# Altium schematic sheet EtherCAT_Sheet.SchDoc
size 420 x 297 mm; SheetNumber: 12; SheetTotal: 14
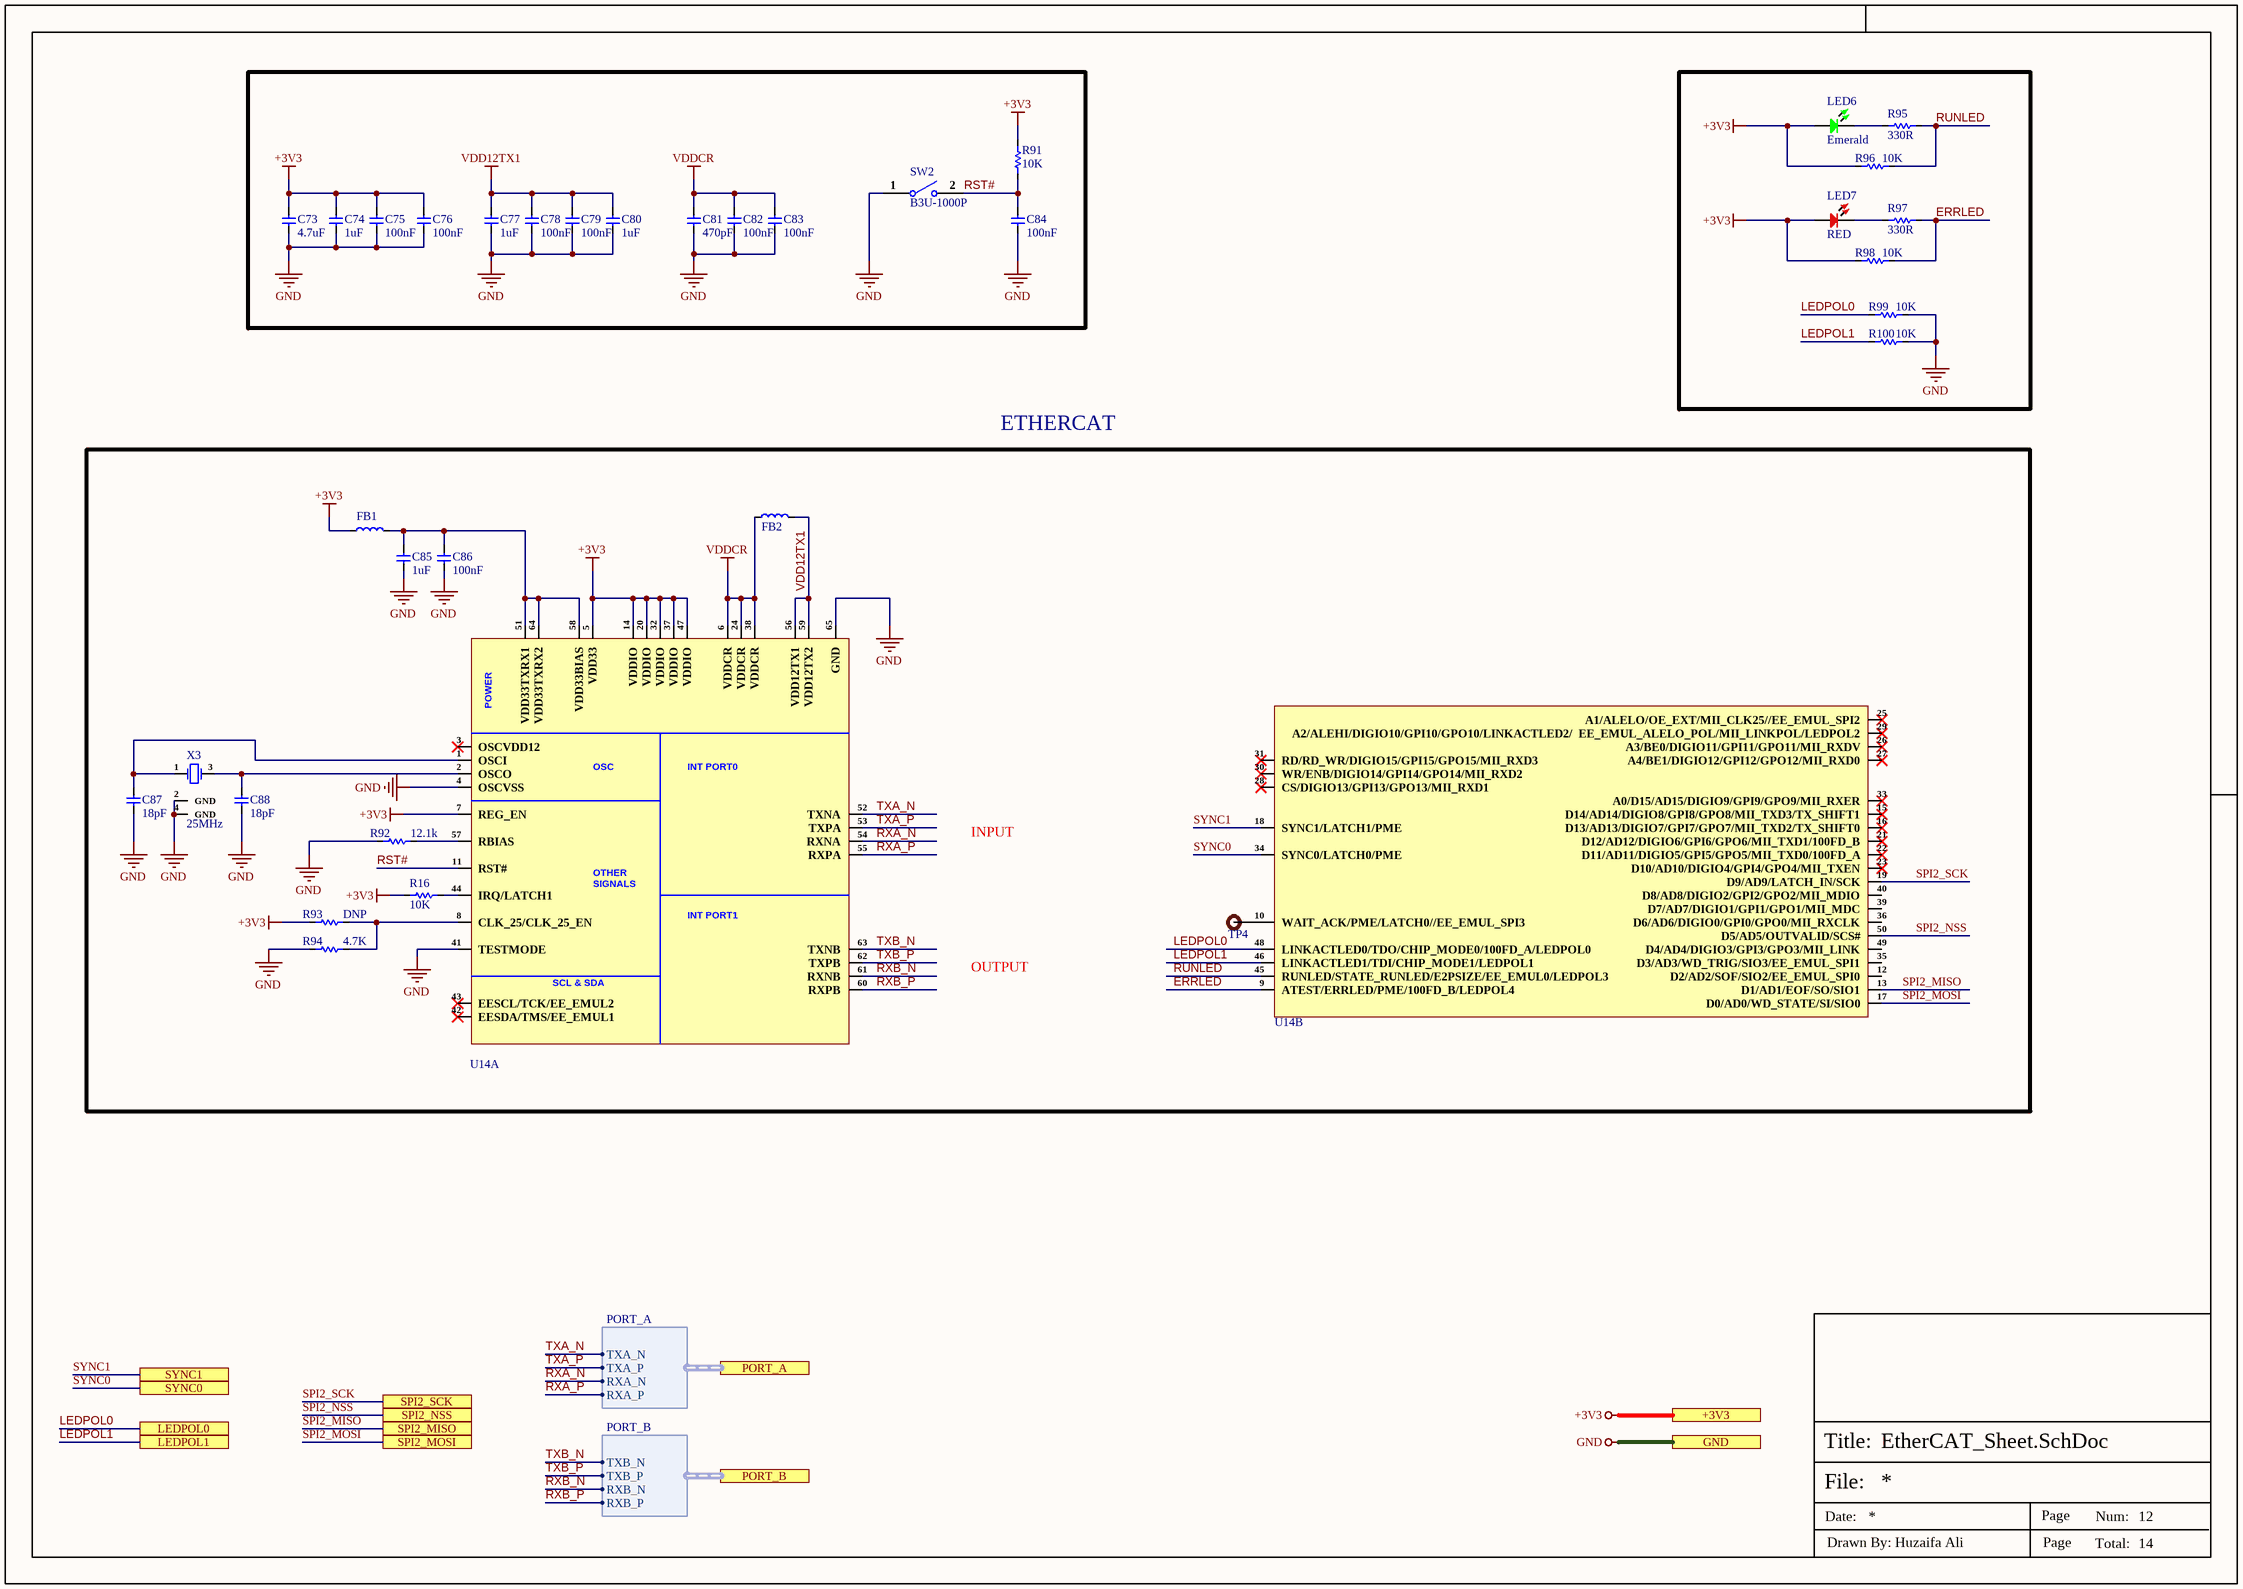
[diagram p0: EtherCAT_Sheet.SchDoc]

## Parts
C73  4.7uF  [Cap-0402]
C74  1uF  [Cap-0402]
C75  100nF  [cap-0402]
C76  100nF  [cap-0402]
C77  1uF  [Cap-0402]
C78  100nF  [cap-0402]
C79  100nF  [cap-0402]
C80  1uF  [Cap-0402]
C81  470pF  [Cap-0603]
C82  100nF  [cap-0402]
C83  100nF  [cap-0402]
C84  100nF  [cap-0402]
C85  1uF  [Cap-0402]
C86  100nF  [cap-0402]
C87  18pF  [Cap-0402]
C88  18pF  [Cap-0402]
FB1  BLM15PG100SN1D  [IND-0402]  (value not drawn)
FB2  BLM15PG100SN1D  [IND-0402]  (value not drawn)
LED6  Emerald  [LED-0603]
LED7  RED  [LED-0603]
R16  10K  [Res-0402]
R91  10K  [Res-0402]
R92  12.1k  [Res-0402]
R93  DNP  [Res-0402]
R94  4.7K  [Res-0402]
R95  330R  [Res-0603]
R96  10K  [Res-0402]
R97  330R  [Res-0603]
R98  10K  [Res-0402]
R99  10K  [Res-0402]
R100  10K  [Res-0402]
SW2  B3U-1000P  [B3U-1000P]
TP4  TEST POINT  [Test-point]  (value not drawn)  (no BOM)
U14  LAN9253-SVB QFN64  [QFN-64-EP(9x9)]  (value not drawn)  (parts A,B of 2)
X3  25MHz  [SMD3225-4P]

## Ports
+3V3 (see Top_Sheet[2A], CAN_Sheet[5D], Controller_Sheet[5D], GPIO_EXPANDER_Sheet[5D], Power_Sheet[5D], RJ45_Sheet[5D], RS485_RS232_Sheet[2D], Stepper_Driver_Sheet1[5D], Stepper_Driver_Sheet2[5D], Stepper_Driver_Sheet3[5D], Stepper_Driver_Sheet4[5D]), GND (see Top_Sheet[2B], CAN_Sheet[5D], Connector_Sheet[5D], Controller_Sheet[5D], DIO_Isolation_Sheet[5D], GPIO_EXPANDER_Sheet[5D], Power_Sheet[5D], RJ45_Sheet[5D], RS485_RS232_Sheet[2D], Stepper_Driver_Sheet1[5D], Stepper_Driver_Sheet2[5D], Stepper_Driver_Sheet3[5D], Stepper_Driver_Sheet4[5D]), LEDPOL0 (see Top_Sheet[2B], RJ45_Sheet[2D]), LEDPOL1 (see Top_Sheet[2B], RJ45_Sheet[2D]), PORT_A (harness PORT_A, see Top_Sheet[2B], RJ45_Sheet[1D]), PORT_B (harness PORT_B, see Top_Sheet[2B], RJ45_Sheet[1D]), SPI2_MISO (see Top_Sheet[2B], Controller_Sheet[5D]), SPI2_MOSI (see Top_Sheet[2B], Controller_Sheet[5D]), SPI2_NSS (see Top_Sheet[2B], Controller_Sheet[5D]), SPI2_SCK (see Top_Sheet[2B], Controller_Sheet[5D]), SYNC0 (see Top_Sheet[2B]), SYNC1 (see Top_Sheet[2B])

## Harnesses
PORT_A: TXA_N, TXA_P, RXA_N, RXA_P
PORT_B: TXB_N, TXB_P, RXB_N, RXB_P

## Nets
+3V3: C73.2 C74.2 C75.2 C76.2 FB1.1 LED6.1 LED7.1 R16.1 R91.1 R93.1 R96.2 R98.2 U14.5(VDD33) U14.7(REG_EN) U14.14(VDDIO) U14.20(VDDIO) U14.32(VDDIO) U14.37(VDDIO) U14.47(VDDIO) ; port +3V3
GND: C73.1 C74.1 C75.1 C76.1 C77.1 C78.1 C79.1 C80.1 C81.1 C82.1 C83.1 C84.1 C85.1 C86.1 C87.2 C88.2 R92.1 R94.1 R99.1 R100.1 SW2.1 U14.4(OSCVSS) U14.41(TESTMODE) U14.65(GND) X3.2(GND) X3.4(GND) ; port GND
VDD12TX1: C77.2 C78.2 C79.2 C80.2 FB2.2 U14.56(VDD12TX1) U14.59(VDD12TX2)
VDDCR: C81.2 C82.2 C83.2 FB2.1 U14.6(VDDCR) U14.24(VDDCR) U14.38(VDDCR)
ERRLED: R97.2 R98.1 U14.9(ATEST/ERRLED/PME/100FD_B/LEDPOL4)
LEDPOL0: R99.2 U14.48(LINKACTLED0/TDO/CHIP_MODE0/100FD_A/LEDPOL0) ; port LEDPOL0
LEDPOL1: R100.2 U14.46(LINKACTLED1/TDI/CHIP_MODE1/LEDPOL1) ; port LEDPOL1
RST#: C84.2 R91.2 SW2.2 U14.11(RST#)
RUNLED: R95.2 R96.1 U14.45(RUNLED/STATE_RUNLED/E2PSIZE/EE_EMUL0/LEDPOL3)
RXA_N: U14.54(RXNA) ; port PORT_A.RXA_N
RXA_P: U14.55(RXPA) ; port PORT_A.RXA_P
RXB_N: U14.61(RXNB) ; port PORT_B.RXB_N
RXB_P: U14.60(RXPB) ; port PORT_B.RXB_P
SPI2_MISO: U14.13(D1/AD1/EOF/SO/SIO1) ; port SPI2_MISO
SPI2_MOSI: U14.17(D0/AD0/WD_STATE/SI/SIO0) ; port SPI2_MOSI
SPI2_NSS: U14.50(D5/AD5/OUTVALID/SCS#) ; port SPI2_NSS
SPI2_SCK: U14.19(D9/AD9/LATCH_IN/SCK) ; port SPI2_SCK
SYNC0: U14.34(SYNC0/LATCH0/PME) ; port SYNC0
SYNC1: U14.18(SYNC1/LATCH1/PME) ; port SYNC1
TXA_N: U14.52(TXNA) ; port PORT_A.TXA_N
TXA_P: U14.53(TXPA) ; port PORT_A.TXA_P
TXB_N: U14.63(TXNB) ; port PORT_B.TXB_N
TXB_P: U14.62(TXPB) ; port PORT_B.TXB_P
NetC85_2: C85.2 C86.2 FB1.2 U14.51(VDD33TXRX1) U14.58(VDD33BIAS) U14.64(VDD33TXRX2)
NetC87_1: C87.1 U14.1(OSCI) X3.1(CRYSTAL)
NetC88_1: C88.1 U14.2(OSCO) X3.3(CRYSTAL)
NetLED6_2: LED6.2 R95.1
NetLED7_2: LED7.2 R97.1
NetR16_2: R16.2 U14.44(IRQ/LATCH1)
NetR92_2: R92.2 U14.57(RBIAS)
NetR93_2: R93.2 R94.2 U14.8(CLK_25/CLK_25_EN)
NetTP4_1: TP4.1 U14.10(WAIT_ACK/PME/LATCH0//EE_EMUL_SPI3)

Not connected (* = marked no-connect by the designer): U14 3(OSCVDD12)* 12(D2/AD2/SOF/SIO2/EE_EMUL_SPI0) 15(D14/AD14/DIGIO8/GPI8/GPO8/MII_TXD3/TX_SHIFT1)* 16(D13/AD13/DIGIO7/GPI7/GPO7/MII_TXD2/TX_SHIFT0)* 21(D12/AD12/DIGIO6/GPI6/GPO6/MII_TXD1/100FD_B)* 22(D11/AD11/DIGIO5/GPI5/GPO5/MII_TXD0/100FD_A)* 23(D10/AD10/DIGIO4/GPI4/GPO4/MII_TXEN)* 25(A1/ALELO/OE_EXT/MII_CLK25//EE_EMUL_SPI2)* 26(A3/BE0/DIGIO11/GPI11/GPO11/MII_RXDV)* 27(A4/BE1/DIGIO12/GPI12/GPO12/MII_RXD0)* 28(CS/DIGIO13/GPI13/GPO13/MII_RXD1)* 29(A2/ALEHI/DIGIO10/GPI10/GPO10/LINKACTLED2/__EE_EMUL_ALELO_POL/MII_LINKPOL/LEDPOL2)* 30(WR/ENB/DIGIO14/GPI14/GPO14/MII_RXD2)* 31(RD/RD_WR/DIGIO15/GPI15/GPO15/MII_RXD3)* 33(A0/D15/AD15/DIGIO9/GPI9/GPO9/MII_RXER)* 35(D3/AD3/WD_TRIG/SIO3/EE_EMUL_SPI1) 36(D6/AD6/DIGIO0/GPI0/GPO0/MII_RXCLK) 39(D7/AD7/DIGIO1/GPI1/GPO1/MII_MDC) 40(D8/AD8/DIGIO2/GPI2/GPO2/MII_MDIO) 42(EESDA/TMS/EE_EMUL1)* 43(EESCL/TCK/EE_EMUL2)* 49(D4/AD4/DIGIO3/GPI3/GPO3/MII_LINK)

## Notes on the sheet
- ETHERCAT
- INPUT
- OUTPUT
- File:
- Title:
- Date:
- Page
- Num:
- Total:
- Drawn By: Huzaifa Ali
- (in symbol LAN9253-SVB QFN64, part A) POWER; OSC; INT PORT0; OTHER / SIGNALS; INT PORT1; SCL & SDA

## Library data of the parts
C73 = CC0402KRX5R6BB475: CAP CER 4.7UF 10V X5R 0402; Manufacturer: Yageo; Tolerance: 10%; Supplier 1: Farnell; Manufacturer Part Number: CC0402KRX5R6BB475; RoHS: Yes; Category: Ceramic Capacitors; Stock 1: 20000; Pricing 1: 10000=0.02310, 50000=0.02100 (GBP); Mount: Surface Mount; Case/Package: 0402; Case Code (Imperial): 0402; Case Code (Metric): 1005; Min Operating Temperature: -55°C; Max Operating Temperature: 85°C; Packaging: Cut Tape; Capacitance: 4.7uF; Voltage Rating: 10V; RoHS Compliant: Yes; ComponentLink1URL: http://www.yageo.com/documents/recent/UPY-GPHC_X5R_4V-to-50V_25.pdf?src-supplier=Digi-Key; ComponentLink1Description: http://www.yageo.com/documents/recent/UPY-GPHC_X5R_4V-to-50V_25.pdf?src-supplier=Digi-Key; Supplier Part Number 1: 3871698; LCSC Part Number: C326586
C74 C77 C80 C85 = CC0402KRX5R6BB105: CAP CER 1UF 10V X5R 0402; Manufacturer: Yageo; Tolerance: 10%; Dissipation Factor: 15%; Item Type: Capacitor; Supplier 1: Mouser; Manufacturer Part Number: CC0402KRX5R6BB105; RoHS: Yes; Category: Ceramic Capacitors; Stock 1: 6711367; Pricing 1: 1=0.11000, 10=0.05500, 50=0.05500, 100=0.03300, 500=0.02700, 1000=0.02200, 2500=0.02100, 10000=0.01800 (USD); Mount: Surface Mount; Case/Package: 0402; Number of Pins: 2; Case Code (Metric): 1005; Case Code (Imperial): 0402; Min Operating Temperature: -55°C; Max Operating Temperature: 85°C; Capacitance: 1uF; Dielectric: X5R; Package Quantity: 1; Voltage Rating: 10V; Packaging: Tape and Reel; Voltage Rating (DC): 10V; Termination: SMD/SMT; Resistor Type: Ceramic; Series: CC; Construction: Flat; Length: 1mm; Width: 0.02inch; Height: 0.5mm; Thickness: 0.022inch; Depth: 0.5mm; Radiation Hardening: No; REACH SVHC: No SVHC; Lead Free: Lead Free; Halogen Free: Halogen Free; RoHS Compliant: Yes; ComponentLink1URL: https://datasheet.ciiva.com/176/upy-gphc-x5r-4v-to-50v-12-176704.pdf?src-supplier=Digi-Key; ComponentLink1Description: https://datasheet.ciiva.com/176/upy-gphc-x5r-4v-to-50v-12-176704.pdf?src-supplier=Digi-Key; ComponentLink2URL: https://datasheet.ciiva.com/176/mlccorderingcode-176705.pdf?src-supplier=Digi-Key; ComponentLink2Description: https://datasheet.ciiva.com/176/mlccorderingcode-176705.pdf?src-supplier=Digi-Key; ComponentLink3URL: https://datasheet.ciiva.com/176/mlccorderingcode-176706.pdf?src-supplier=Digi-Key; ComponentLink3Description: https://datasheet.ciiva.com/176/mlccorderingcode-176706.pdf?src-supplier=Digi-Key; Supplier Part Number 1: 603-CC402KRX5R6BB105; LCSC Part Number: C106254
C75 C76 C78 C79 C82-C84 C86 = C1005X7R1H104KT000F: CAP CER 0.1UF 50V X7R 0402; Manufacturer: TDK; Tolerance: 10%; Voltage: 25V; Item Type: Capacitor; Supplier 1: Avnet; Manufacturer Part Number: C1005X7R1H104KT000F; RoHS: No; Category: Ceramic Capacitors; Dielectric: X7R; Supplier Part Number 1: C1005X7R1H104KT000F; LCSC Part Number: C361198; ComponentLink1Description: LCSC; ComponentLink1URL: https://www.lcsc.com/product-detail/Multilayer-Ceramic-Capacitors-MLCC-SMD-SMT_TDK-C1005X7R1H104KT000F_C361198.html
C81 = 0603B471K500CT: CAP CER 470PF 50V X7R 0603; Manufacturer: Walsin Technologies; Tolerance: 10%; Item Type: Capacitor; Supplier 1: Arrow Electronics; Manufacturer Part Number: 0603B471K500CT; RoHS: Yes; Category: Ceramic Capacitors; Stock 1: 136000; Pricing 1: 4000=0.00550, 8000=0.00460, 12000=0.00440, 40000=0.00430 (USD); Case/Package: Ceramic; Case Code (Metric): 1608; Case Code (Imperial): 0603; Min Operating Temperature: -55°C; Max Operating Temperature: 125°C; Capacitance: 470pF; Packaging: Tape and Reel; Dielectric: X7R; Voltage Rating: 50V; Voltage Rating (DC): 50V; Length: 1.6mm; Depth: 0.8mm; Radiation Hardening: No; RoHS Compliant: Yes; REACH SVHC: Unknown; Lead Free: Lead Free; ComponentLink1URL: https://www.verical.com/server-webapp/html/getDatasheet?partID=467798&src-supplier=Verical; ComponentLink1Description: https://www.verical.com/server-webapp/html/getDatasheet?partID=467798&src-supplier=Verical; ComponentLink2URL: http://www.farnell.com/datasheets/2340522.pdf?src-supplier=Farnell; ComponentLink2Description: http://www.farnell.com/datasheets/2340522.pdf?src-supplier=Farnell; ComponentLink3URL: http://www.passivecomponent.com/indexsea/0603B471K500CT-IS.pdf?src-supplier=Digi-Key; ComponentLink3Description: http://www.passivecomponent.com/indexsea/0603B471K500CT-IS.pdf?src-supplier=Digi-Key; ComponentLink4URL: http://www.passivecomponent.com/wp-content/uploads/2018/10/MLCC.pdf?src-supplier=Digi-Key; ComponentLink4Description: http://www.passivecomponent.com/wp-content/uploads/2018/10/MLCC.pdf?src-supplier=Digi-Key; ComponentLink5URL: http://www.farnell.com/datasheets/1958513.pdf?src-supplier=Element14; ComponentLink5Description: http://www.farnell.com/datasheets/1958513.pdf?src-supplier=Element14; ComponentLink6URL: http://www.farnell.com/datasheets/2340522.pdf?src-supplier=Newark; ComponentLink6Description: http://www.farnell.com/datasheets/2340522.pdf?src-supplier=Newark; Supplier Part Number 1: 0603B471K500CT; LCSC Part Number: C93192
C87 C88 = GCM1555C1H180GA16D: CAP CER 18PF 50V C0G/NP0 0402; Manufacturer: Murata; Tolerance: 2%; Item Type: Capacitor; Supplier: Rs; Supplier Part Number: 2477793P; Manufacturer Part Number: GCM1555C1H180GA16D; RoHS: Yes; Category: Ceramic Capacitors; Stock: 10000; Pricing: 500=0.013, 5000=0.009 (GBP); Mounting Technology: Surface Mount; Case/Package: 0402; Case Code (Imperial): 0402; Case Code (Metric): 1005; Min Operating Temperature: -55°C; Max Operating Temperature: 125°C; Packaging: Cut Tape; Value: 18pF; Voltage Rating: 50V; Series: GCM; Ratings: AEC-Q200; RoHS Compliant: Yes; ComponentLink1URL: http://search.murata.co.jp/Ceramy/image/img/A01X/G101/ENG/GCM1555C1H180GA16-01.pdf?src-supplier=Digi-Key; ComponentLink1Description: http://search.murata.co.jp/Ceramy/image/img/A01X/G101/ENG/GCM1555C1H180GA16-01.pdf?src-supplier=Digi-Key; ComponentLink2URL: https://search.murata.co.jp/Ceramy/image/img/A01X/G101/ENG/GCM1555C1H180GA16-01.pdf?src-supplier=Digi-Key; ComponentLink2Description: https://search.murata.co.jp/Ceramy/image/img/A01X/G101/ENG/GCM1555C1H180GA16-01.pdf?src-supplier=Digi-Key; ComponentLink3URL: https://datasheet.octopart.com/GCM1555C1H180GA16D-Murata-datasheet-149522315.pdf?src-supplier=Newark; ComponentLink3Description: https://datasheet.octopart.com/GCM1555C1H180GA16D-Murata-datasheet-149522315.pdf?src-supplier=Newark; ComponentLink4URL: https://datasheet.octopart.com/GCM1555C1H180GA16D-Murata-datasheet-12511495.pdf?src-supplier=TME; ComponentLink4Description: https://datasheet.octopart.com/GCM1555C1H180GA16D-Murata-datasheet-12511495.pdf?src-supplier=TME; LCSC Part Number: C882583
FB1 FB2 = BLM15PG100SN1D: FERRITE BEAD 10 OHM 0402 1LN; Manufacturer: Murata; Material: Steel; Impedance: 10R; Current Rating: 1A; Number of Lines: 1; DC Resistance (DCR): 25mR; Shielding: Unshielded; Tolerance: 25%; Test Frequency: 100MHz; DC Resistance-Max: 50mR; Supplier 1: Arrow Electronics; Manufacturer Part Number: BLM15PG100SN1D; RoHS: Yes; Category: Ferrite Beads and Chips; Stock 1: 9684; Pricing 1: 1=0.10900, 10=0.06930, 25=0.05030, 50=0.04970, 100=0.03510, 250=0.03470, 500=0.03030, 1000=0.03000, 3000=0.02970, 6000=0.02640 (USD); Case/Package: 0402; Number of Pins: 2; Core Material: Ferrite; Case Code (Metric): 1005; Case Code (Imperial): 0402; Min Operating Temperature: -55°C; Max Operating Temperature: 125°C; Packaging: Tape and Reel; Number of Circuits: 1; Package Quantity: 1; Max Current Rating: 1A; Termination: SMD/SMT; Max DC Current: 1A; Series: BLM15PG; Length: 1mm; Width: 0.5mm; Height: 0.5mm; Depth: 0.55mm; REACH SVHC: No SVHC; Lead Free: Lead Free; RoHS Compliant: Yes; ComponentLink1URL: https://datasheet.ciiva.com/41449/001172209-da-01-en-drossel-0402-10r-1-0x0-5mm-10000st-41449496.pdf?src-supplier=Conrad; ComponentLink1Description: https://datasheet.ciiva.com/41449/001172209-da-01-en-drossel-0402-10r-1-0x0-5mm-10000st-41449496.pdf?src-supplier=Conrad; ComponentLink2URL: https://datasheet.ciiva.com/46423/1851892-46423898.pdf?src-supplier=Element14; ComponentLink2Description: https://datasheet.ciiva.com/46423/1851892-46423898.pdf?src-supplier=Element14; ComponentLink3URL: https://datasheet.ciiva.com/6211/l0110e-6211726.pdf?src-supplier=Digi-Key; ComponentLink3Description: https://datasheet.ciiva.com/6211/l0110e-6211726.pdf?src-supplier=Digi-Key; Supplier Part Number 1: BLM15PG100SN1D; LCSC Part Number: C85823; Item Type: Ferrite Bead
LED6 = NCD0603G2: Emerald 0603 Light Emitting Diodes (LED) ROHS; Manufacturer: Foshan NationStar Optoelectronics; Manufacturer Part Number: NCD0603G2; Package: 0603; LCSC Part Number: C87326; Item Type: LED; ComponentLink1Description: LCSC; ComponentLink1URL: https://www.lcsc.com/product-detail/Light-Emitting-Diodes-LED_Foshan-NationStar-Optoelectronics-NCD0603G2_C87326.html
LED7 = NCD0603R3: RED LED 0603 Light Emitting Diodes; Manufacturer: Foshan NationStar Optoelectronics; Manufacturer Part Number: NCD0603R3; Package: 0603; Item Type: LED; LCSC Part Number: C3151730; ComponentLink1Description: LCSC; ComponentLink1URL: https://www.lcsc.com/product-detail/Light-Emitting-Diodes-LED_Foshan-NationStar-Optoelectronics-NCD0603R3_C3151730.html
R16 R91 R96 R98-R100 = RC0402FR-0710KL: RES 10K OHM 1% 1/16W 0402; Manufacturer: Yageo; Resistance: 10kR; Voltage Rating (DC): 50V; Temperature Coefficient: 100ppm/°C; Power Rating: 62.5mW; Max Power Dissipation: 63mW; Item Type: Resistor; Supplier 1: Mouser; Manufacturer Part Number: RC0402FR-0710KL; RoHS: Yes; Category: Chip SMD Resistors; Stock 1: 18648329; Pricing 1: 1=0.10000, 10=0.01400, 50=0.01400, 100=0.00500, 1000=0.00300, 10000=0.00200 (USD); Case/Package: 0402; Number of Pins: 2; Case Code (Imperial): 0402; Case Code (Metric): 1005; Min Operating Temperature: -55°C; Max Operating Temperature: 155°C; Resistor Type: Thick Film; Tolerance: 1%; Packaging: Tape and Reel; Voltage Rating: 50V; Termination: SMD/SMT; Working Voltage: 50V; Number of Terminations: 2; Features: Moisture Resistant; Series: RC; Resistance Tolerance: 1%; Construction: Rectangular; Length: 1mm; Width: 0.5mm; Height: 0.32mm; Depth: 0.5mm; Lead Pitch: 0.2mm; REACH SVHC: No SVHC; Lead Free: Lead Free; RoHS Compliant: Yes; Military Standard: Not; ComponentLink1URL: https://datasheet.ciiva.com/7660/38568-7660787.pdf?src-supplier=Element14; ComponentLink1Description: https://datasheet.ciiva.com/7660/38568-7660787.pdf?src-supplier=Element14; ComponentLink2URL: https://datasheet.ciiva.com/7849/1686128-7849814.pdf?src-supplier=Element14; ComponentLink2Description: https://datasheet.ciiva.com/7849/1686128-7849814.pdf?src-supplier=Element14; ComponentLink3URL: https://datasheet.ciiva.com/7983/1018594-7983486.pdf?src-supplier=Element14; ComponentLink3Description: https://datasheet.ciiva.com/7983/1018594-7983486.pdf?src-supplier=Element14; ComponentLink4URL: https://datasheet.ciiva.com/22747/1018594-22747512.pdf?src-supplier=Element14; ComponentLink4Description: https://datasheet.ciiva.com/22747/1018594-22747512.pdf?src-supplier=Element14; ComponentLink5URL: https://datasheet.ciiva.com/12667/pyu-rc0402-51-rohs-l-6-r-12667067.pdf?src-supplier=Mouser; ComponentLink5Description: https://datasheet.ciiva.com/12667/pyu-rc0402-51-rohs-l-6-r-12667067.pdf?src-supplier=Mouser; ComponentLink6URL: https://datasheet.ciiva.com/7849/1784430-7849813.pdf?src-supplier=Element14; ComponentLink6Description: https://datasheet.ciiva.com/7849/1784430-7849813.pdf?src-supplier=Element14; ComponentLink7URL: https://datasheet.ciiva.com/7849/1784430-7849815.pdf?src-supplier=Element14; ComponentLink7Description: https://datasheet.ciiva.com/7849/1784430-7849815.pdf?src-supplier=Element14; Supplier Part Number 1: 603-RC0402FR-0710KL; LCSC Part Number: C60490
R92 = RT0402BRD0712K1L: RES SMD 12.1KOHM 0.1% 1/16W 0402; Manufacturer: Yageo; Item Type: Resistor; Supplier: Future Electronics; Supplier Part Number: 2068365; Manufacturer Part Number: RT0402BRD0712K1L; RoHS: Yes; Category: Chip SMD Resistors; Stock: 60000; Pricing: 10000=0.0245, 20000=0.0217, 30000=0.0237, 50000=0.0233, 100000=0.0228, 200000=0.022 (USD); ComponentLink1URL: https://datasheet.ciiva.com/12812/pyu-rt-1-to-0-05-rohs-l-4-12812462.pdf?src-supplier=Mouser; ComponentLink1Description: https://datasheet.ciiva.com/12812/pyu-rt-1-to-0-05-rohs-l-4-12812462.pdf?src-supplier=Mouser; LCSC Part Number: C281773
R93 R94 = RC0402FR-074K7L: RES 4.7K OHM 1% 1/16W 0402; Manufacturer: Yageo; Voltage Rating (DC): 50V; Power Rating: 62.5mW; Resistance: 4.7kR; Temperature Coefficient: 100ppm/°C; Max Power Dissipation: 63mW; Item Type: Resistor; Supplier 1: Avnet; Manufacturer Part Number: RC0402FR-074K7L; RoHS: Yes; Category: Chip SMD Resistors; Stock 1: 2420000; Pricing 1: 10000=0.00085 (USD); Case/Package: 0402; Number of Pins: 2; Case Code (Imperial): 0402; Case Code (Metric): 1005; Size Code: 0402; Min Operating Temperature: -55°C; Max Operating Temperature: 155°C; Tolerance: 1%; Voltage Rating: 50V; Packaging: Tape and Reel; Resistor Type: Thick Film; Termination: SMD/SMT; Features: Moisture Resistant; Series: RC; Number of Terminations: 2; Resistance Tolerance: 1%; Construction: Rectangular; Length: 1mm; Width: 0.5mm; Height: 0.32mm; Depth: 0.5mm; Height - Seated (Max): 0.016inch; RoHS Compliant: Yes; Reach SVHC Compliant: Yes; Military Standard: Not; Lead Free: Lead Free; ComponentLink1URL: https://datasheet.ciiva.com/22661/1686128-22661342.pdf?src-supplier=Element14; ComponentLink1Description: https://datasheet.ciiva.com/22661/1686128-22661342.pdf?src-supplier=Element14; ComponentLink2URL: https://datasheet.ciiva.com/7850/1018594-7850022.pdf?src-supplier=Element14; ComponentLink2Description: https://datasheet.ciiva.com/7850/1018594-7850022.pdf?src-supplier=Element14; ComponentLink3URL: https://datasheet.ciiva.com/7850/1018594-7850023.pdf?src-supplier=Element14; ComponentLink3Description: https://datasheet.ciiva.com/7850/1018594-7850023.pdf?src-supplier=Element14; ComponentLink4URL: https://datasheet.ciiva.com/15215/getdatasheetpartid-328119-15215035.pdf?src-supplier=Verical; ComponentLink4Description: https://datasheet.ciiva.com/15215/getdatasheetpartid-328119-15215035.pdf?src-supplier=Verical; Supplier Part Number 1: RC0402FR-074K7L; LCSC Part Number: C105871
R95 R97 = RC0603JR-07330RL: RES  SMD 330R 100 mW 0603; Manufacturer: Yageo; Power Rating: 100mW; Tolerance: 5%; Voltage Rating (DC): 50V; Temperature Coefficient: 100ppm/°C; Item Type: Resistor; Supplier 1: Digi-Key; Manufacturer Part Number: RC0603JR-07330RL; RoHS: Yes; Category: Chip SMD Resistors; Stock 1: 1074593; Pricing 1: 1=0.10000, 10=0.02000, 100=0.00800, 1000=0.00360, 2500=0.00312 (USD); Case/Package: 0603; Number of Pins: 2; Case Code (Imperial): 0603; Case Code (Metric): 1608; Size Code: 0603; Min Operating Temperature: -55°C; Max Operating Temperature: 155°C; Resistance: 330R; Packaging: Tape and Reel; Voltage Rating: 50V; Package Quantity: 5000; Termination: SMD/SMT; Resistor Type: Thick Film; Features: Moisture Resistant; Series: RC; Max Power Dissipation: 100mW; Number of Terminations: 2; Resistance Tolerance: 5%; Construction: Rectangular; Length: 1.6mm; Width: 0.8mm; Height: 0.45mm; Depth: 0.8mm; REACH SVHC: No SVHC; Lead Free: Lead Free; Military Standard: Not; RoHS Compliant: Yes; Supplier Part Number 1: 311-330GRCT-ND; LCSC Part Number: C105879
SW2 = B3U-1000P: SWITCH TACTILE SPST-NO 0.05A 12V; Manufacturer: Omron; Mechanical Life: 200000Cycles; Operating Force: 1.5N; Throw Configuration: SPST; Current Rating: 50mA; Contact Resistance: 100mR; Illumination Type: Non-Illuminated,Illuminated; Switch Travel: 0.15mm; Switch Function: Off-Mom; Actuator Type: Standard; Actuator Length: 0.4mm; Ratings: Dust Proof,IP40; ComponentLink1URL: http://www.farnell.com/datasheets/60838.pdf?src-supplier=Farnell; ComponentLink1Description: http://www.farnell.com/datasheets/60838.pdf?src-supplier=Farnell; ComponentLink2URL: http://www.farnell.com/datasheets/60838.pdf?src-supplier=Element14; ComponentLink2Description: http://www.farnell.com/datasheets/60838.pdf?src-supplier=Element14; ComponentLink3URL: https://omronfs.omron.com/en_US/ecb/products/pdf/en-b3u.pdf?src-supplier=Digi-Key; ComponentLink3Description: https://omronfs.omron.com/en_US/ecb/products/pdf/en-b3u.pdf?src-supplier=Digi-Key; ComponentLink4URL: http://www.omron.com/ecb/products/pdf/en-b3u.pdf?src-supplier=Digi-Key; ComponentLink4Description: http://www.omron.com/ecb/products/pdf/en-b3u.pdf?src-supplier=Digi-Key; ComponentLink5URL: https://www.distrelec.biz/Web/Downloads/he/et/B3U_eng_datasheet.pdf?mime=application%2Fpdf&src-supplier=Distrelec; ComponentLink5Description: https://www.distrelec.biz/Web/Downloads/he/et/B3U_eng_datasheet.pdf?mime=application%2Fpdf&src-supplier=Distrelec; ComponentLink6URL: http://www.onlinecomponents.com/productFiles/mf-OM/en-b3u.pdf?src-supplier=Onlinecomponents.com; ComponentLink6Description: http://www.onlinecomponents.com/productFiles/mf-OM/en-b3u.pdf?src-supplier=Onlinecomponents.com; Supplier 1: Digi-Key; Manufacturer Part Number: B3U-1000P; Stock 1: 116454; Pricing 1: 1=1, 10=0.961, 25=0.9064, 50=0.7976, 100=0.7251, 250=0.68888, 500=0.67074, 1000=0.52571 (USD); Mount: Surface Mount; Weight: 0.000776oz; Contact Material: Silver; Min Operating Temperature: -25°C; Max Operating Temperature: 70°C; Packaging: Tape and Reel; Voltage Rating (DC): 12V; Package Quantity: 1; Max Current Rating: 50mA; Termination: SMD/SMT; Orientation: Straight; Max Voltage Rating (DC): 12V; Electrical Life: 200000Cycles; Insulation Resistance: 100MR; Contact Current Rating: 50mA; Length: 4mm; Height: 1.2mm; Depth: 2.5mm; Width: 3mm; REACH SVHC: Unknown; Lead Free: Lead Free; ComponentLink7URL: https://www.verical.com/server-webapp/html/getDatasheet?partID=552554&src-supplier=Verical; ComponentLink7Description: https://www.verical.com/server-webapp/html/getDatasheet?partID=552554&src-supplier=Verical; ComponentLink8URL: http://www.farnell.com/datasheets/1685550.pdf?src-supplier=Element14; ComponentLink8Description: http://www.farnell.com/datasheets/1685550.pdf?src-supplier=Element14; ComponentLink9URL: http://www.farnell.com/datasheets/2610940.pdf?src-supplier=Farnell; ComponentLink9Description: http://www.farnell.com/datasheets/2610940.pdf?src-supplier=Farnell; ComponentLink10URL: https://www.alliedelec.com/m/d/4c8a9ef82804fc3c241a13c1e298fd73.pdf?src-supplier=Allied+Electronics; ComponentLink10Description: https://www.alliedelec.com/m/d/4c8a9ef82804fc3c241a13c1e298fd73.pdf?src-supplier=Allied+Electronics; Supplier Part Number 1: SW1020DKR-ND; LCSC Part Number: C231329; Item Type: Switch
TP4 = TEST POINT: Test Point ON; Item Type: TEST POINT
U14 = LAN9253-SVB QFN64: 2/3-PORT ETHERCAT SLAVE CTLR; Manufacturer: Microchip; Manufacturer Part Number: LAN9253-I/R4X; Item Type: IC; Revision: 2; ComponentLink1Description: SVN Datasheet; ComponentLink2Description: Local Datasheet; ComponentLink5Description: Open Footprint 2; ComponentLink6Description: Open Footprint 3; Supplier: Digikey; Supplier Part Number: 150-LAN9253-I/R4X-ND; RoHS: Yes; Stock: 364; Pricing: 1=13.43, 25=11.2, 100=10.825 (USD)
X3 = X322525MRB4SI: 25MHz 贴片晶振 18pF ±10ppm ±20ppm SMD3225-4P Crystals ROHS; Manufacturer: YXC; Supplier: LCSC; LCSC Part Number: C70593; Manufacturer Part Number: X322525MRB4SI; RoHS: No; Item Type: Crystal